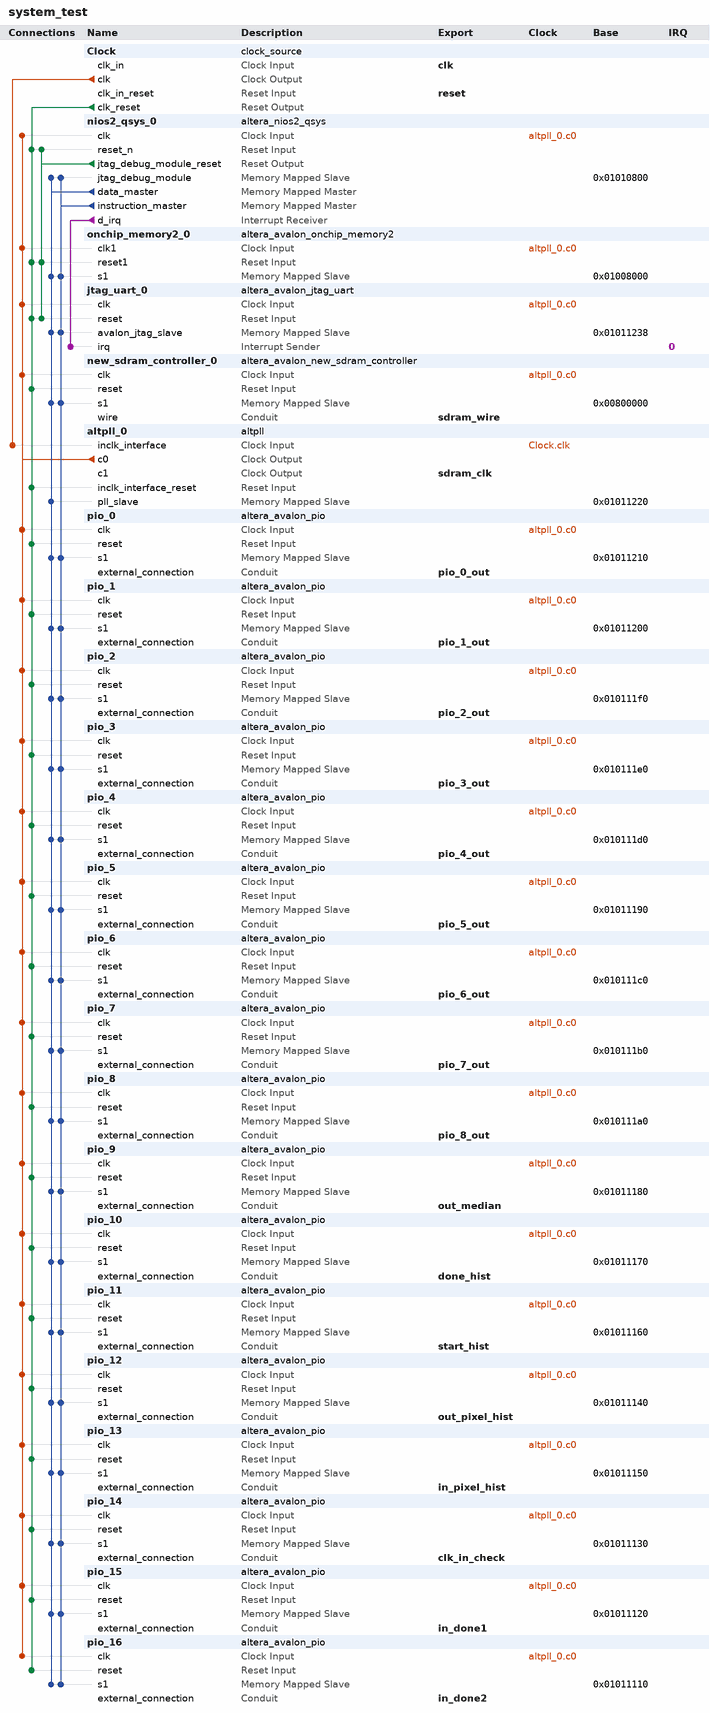
[diagram p0: system contents]
# Platform Designer (Qsys) system system_test, Cyclone II EP2C35F672C6
# Parameters at their usual value, and those the tool derives, are not listed.
package require -exact qsys 13.0.1.99.2
create_system system_test
set_project_property DEVICE_FAMILY {Cyclone II}
set_project_property DEVICE EP2C35F672C6

add_instance Clock clock_source 13.0
set_instance_parameter_value Clock clockFrequency 50000000

add_instance nios2_qsys_0 altera_nios2_qsys 13.0
set_instance_parameter_value nios2_qsys_0 resetSlave onchip_memory2_0.s1
set_instance_parameter_value nios2_qsys_0 mmu_TLBMissExcSlave None
set_instance_parameter_value nios2_qsys_0 exceptionSlave onchip_memory2_0.s1
set_instance_parameter_value nios2_qsys_0 breakSlave nios2_qsys_0.jtag_debug_module
set_instance_parameter_value nios2_qsys_0 impl Tiny
set_instance_parameter_value nios2_qsys_0 icache_size 4096

add_instance onchip_memory2_0 altera_avalon_onchip_memory2 13.0.1.99.2
set_instance_parameter_value onchip_memory2_0 dataWidth 32
set_instance_parameter_value onchip_memory2_0 dualPort false
set_instance_parameter_value onchip_memory2_0 initMemContent true
set_instance_parameter_value onchip_memory2_0 initializationFileName onchip_mem.hex
set_instance_parameter_value onchip_memory2_0 memorySize 32768

add_instance jtag_uart_0 altera_avalon_jtag_uart 13.0.1.99.2
set_instance_parameter_value jtag_uart_0 simInteractiveOptions NO_INTERACTIVE_WINDOWS

add_instance new_sdram_controller_0 altera_avalon_new_sdram_controller 13.0.1.99.2
set_instance_parameter_value new_sdram_controller_0 TAC 5.5
set_instance_parameter_value new_sdram_controller_0 TRCD 20.0
set_instance_parameter_value new_sdram_controller_0 TRP 20.0
set_instance_parameter_value new_sdram_controller_0 casLatency 3
set_instance_parameter_value new_sdram_controller_0 columnWidth 8
set_instance_parameter_value new_sdram_controller_0 dataWidth 16
set_instance_parameter_value new_sdram_controller_0 generateSimulationModel false
set_instance_parameter_value new_sdram_controller_0 model single_Micron_MT48LC4M32B2_7_chip
set_instance_parameter_value new_sdram_controller_0 numberOfBanks 4
set_instance_parameter_value new_sdram_controller_0 numberOfChipSelects 1
set_instance_parameter_value new_sdram_controller_0 powerUpDelay 100.0
set_instance_parameter_value new_sdram_controller_0 refreshPeriod 15.625
set_instance_parameter_value new_sdram_controller_0 rowWidth 12

add_instance altpll_0 altpll 13.0
set_instance_parameter_value altpll_0 INCLK0_INPUT_FREQUENCY 20000
set_instance_parameter_value altpll_0 GATE_LOCK_SIGNAL NO
set_instance_parameter_value altpll_0 VALID_LOCK_MULTIPLIER 1
set_instance_parameter_value altpll_0 INVALID_LOCK_MULTIPLIER 5
set_instance_parameter_value altpll_0 CLK0_MULTIPLY_BY 1
set_instance_parameter_value altpll_0 CLK1_MULTIPLY_BY 1
set_instance_parameter_value altpll_0 CLK0_DIVIDE_BY 1
set_instance_parameter_value altpll_0 CLK1_DIVIDE_BY 1
set_instance_parameter_value altpll_0 CLK1_PHASE_SHIFT -3000
set_instance_parameter_value altpll_0 CLK1_DUTY_CYCLE 50
set_instance_parameter_value altpll_0 PORT_clk1 PORT_USED
set_instance_parameter_value altpll_0 PORT_clk2 PORT_UNUSED
set_instance_parameter_value altpll_0 PORT_clk3 PORT_UNUSED
set_instance_parameter_value altpll_0 PORT_ARESET PORT_USED
set_instance_parameter_value altpll_0 PORT_LOCKED PORT_USED

add_instance pio_0 altera_avalon_pio 13.0.1.99.2
set_instance_parameter_value pio_0 direction Output
set_instance_parameter_value pio_0 width 8

add_instance pio_1 altera_avalon_pio 13.0.1.99.2
set_instance_parameter_value pio_1 direction Output
set_instance_parameter_value pio_1 width 8

add_instance pio_2 altera_avalon_pio 13.0.1.99.2
set_instance_parameter_value pio_2 direction Output
set_instance_parameter_value pio_2 width 8

add_instance pio_3 altera_avalon_pio 13.0.1.99.2
set_instance_parameter_value pio_3 direction Output
set_instance_parameter_value pio_3 width 8

add_instance pio_4 altera_avalon_pio 13.0.1.99.2
set_instance_parameter_value pio_4 direction Output
set_instance_parameter_value pio_4 width 8

add_instance pio_5 altera_avalon_pio 13.0.1.99.2
set_instance_parameter_value pio_5 direction Output
set_instance_parameter_value pio_5 width 8

add_instance pio_6 altera_avalon_pio 13.0.1.99.2
set_instance_parameter_value pio_6 direction Output
set_instance_parameter_value pio_6 width 8

add_instance pio_7 altera_avalon_pio 13.0.1.99.2
set_instance_parameter_value pio_7 direction Output
set_instance_parameter_value pio_7 width 8

add_instance pio_8 altera_avalon_pio 13.0.1.99.2
set_instance_parameter_value pio_8 direction Output
set_instance_parameter_value pio_8 width 8

add_instance pio_9 altera_avalon_pio 13.0.1.99.2
set_instance_parameter_value pio_9 direction Input
set_instance_parameter_value pio_9 width 8

add_instance pio_10 altera_avalon_pio 13.0.1.99.2
set_instance_parameter_value pio_10 direction Input
set_instance_parameter_value pio_10 width 1

add_instance pio_11 altera_avalon_pio 13.0.1.99.2
set_instance_parameter_value pio_11 direction Output
set_instance_parameter_value pio_11 width 1

add_instance pio_12 altera_avalon_pio 13.0.1.99.2
set_instance_parameter_value pio_12 direction Output
set_instance_parameter_value pio_12 width 8

add_instance pio_13 altera_avalon_pio 13.0.1.99.2
set_instance_parameter_value pio_13 direction Input
set_instance_parameter_value pio_13 width 8

add_instance pio_14 altera_avalon_pio 13.0.1.99.2
set_instance_parameter_value pio_14 direction Input
set_instance_parameter_value pio_14 width 1

add_instance pio_15 altera_avalon_pio 13.0.1.99.2
set_instance_parameter_value pio_15 direction Input
set_instance_parameter_value pio_15 width 1

add_instance pio_16 altera_avalon_pio 13.0.1.99.2
set_instance_parameter_value pio_16 direction Input
set_instance_parameter_value pio_16 width 1

# connections
add_connection altpll_0.c0 jtag_uart_0.clk clock
add_connection altpll_0.c0 new_sdram_controller_0.clk clock
add_connection altpll_0.c0 nios2_qsys_0.clk clock
add_connection altpll_0.c0 onchip_memory2_0.clk1 clock
add_connection altpll_0.c0 pio_0.clk clock
add_connection altpll_0.c0 pio_1.clk clock
add_connection altpll_0.c0 pio_2.clk clock
add_connection altpll_0.c0 pio_3.clk clock
add_connection altpll_0.c0 pio_4.clk clock
add_connection altpll_0.c0 pio_5.clk clock
add_connection altpll_0.c0 pio_6.clk clock
add_connection altpll_0.c0 pio_7.clk clock
add_connection altpll_0.c0 pio_8.clk clock
add_connection altpll_0.c0 pio_9.clk clock
add_connection altpll_0.c0 pio_10.clk clock
add_connection altpll_0.c0 pio_11.clk clock
add_connection altpll_0.c0 pio_12.clk clock
add_connection altpll_0.c0 pio_13.clk clock
add_connection altpll_0.c0 pio_14.clk clock
add_connection altpll_0.c0 pio_15.clk clock
add_connection altpll_0.c0 pio_16.clk clock
add_connection Clock.clk altpll_0.inclk_interface clock
add_connection Clock.clk_reset altpll_0.inclk_interface_reset reset
add_connection Clock.clk_reset jtag_uart_0.reset reset
add_connection Clock.clk_reset new_sdram_controller_0.reset reset
add_connection Clock.clk_reset nios2_qsys_0.reset_n reset
add_connection Clock.clk_reset onchip_memory2_0.reset1 reset
add_connection Clock.clk_reset pio_0.reset reset
add_connection Clock.clk_reset pio_1.reset reset
add_connection Clock.clk_reset pio_2.reset reset
add_connection Clock.clk_reset pio_3.reset reset
add_connection Clock.clk_reset pio_4.reset reset
add_connection Clock.clk_reset pio_5.reset reset
add_connection Clock.clk_reset pio_6.reset reset
add_connection Clock.clk_reset pio_7.reset reset
add_connection Clock.clk_reset pio_8.reset reset
add_connection Clock.clk_reset pio_9.reset reset
add_connection Clock.clk_reset pio_10.reset reset
add_connection Clock.clk_reset pio_11.reset reset
add_connection Clock.clk_reset pio_12.reset reset
add_connection Clock.clk_reset pio_13.reset reset
add_connection Clock.clk_reset pio_14.reset reset
add_connection Clock.clk_reset pio_15.reset reset
add_connection Clock.clk_reset pio_16.reset reset
add_connection nios2_qsys_0.jtag_debug_module_reset jtag_uart_0.reset reset
add_connection nios2_qsys_0.jtag_debug_module_reset nios2_qsys_0.reset_n reset
add_connection nios2_qsys_0.jtag_debug_module_reset onchip_memory2_0.reset1 reset
add_connection nios2_qsys_0.data_master altpll_0.pll_slave avalon
set_connection_parameter_value nios2_qsys_0.data_master/altpll_0.pll_slave baseAddress 0x01011220
add_connection nios2_qsys_0.data_master jtag_uart_0.avalon_jtag_slave avalon
set_connection_parameter_value nios2_qsys_0.data_master/jtag_uart_0.avalon_jtag_slave baseAddress 0x01011238
add_connection nios2_qsys_0.data_master new_sdram_controller_0.s1 avalon
set_connection_parameter_value nios2_qsys_0.data_master/new_sdram_controller_0.s1 baseAddress 0x00800000
add_connection nios2_qsys_0.data_master nios2_qsys_0.jtag_debug_module avalon
set_connection_parameter_value nios2_qsys_0.data_master/nios2_qsys_0.jtag_debug_module baseAddress 0x01010800
add_connection nios2_qsys_0.data_master onchip_memory2_0.s1 avalon
set_connection_parameter_value nios2_qsys_0.data_master/onchip_memory2_0.s1 baseAddress 0x01008000
add_connection nios2_qsys_0.data_master pio_0.s1 avalon
set_connection_parameter_value nios2_qsys_0.data_master/pio_0.s1 baseAddress 0x01011210
add_connection nios2_qsys_0.data_master pio_1.s1 avalon
set_connection_parameter_value nios2_qsys_0.data_master/pio_1.s1 baseAddress 0x01011200
add_connection nios2_qsys_0.data_master pio_2.s1 avalon
set_connection_parameter_value nios2_qsys_0.data_master/pio_2.s1 baseAddress 0x010111f0
add_connection nios2_qsys_0.data_master pio_3.s1 avalon
set_connection_parameter_value nios2_qsys_0.data_master/pio_3.s1 baseAddress 0x010111e0
add_connection nios2_qsys_0.data_master pio_4.s1 avalon
set_connection_parameter_value nios2_qsys_0.data_master/pio_4.s1 baseAddress 0x010111d0
add_connection nios2_qsys_0.data_master pio_5.s1 avalon
set_connection_parameter_value nios2_qsys_0.data_master/pio_5.s1 baseAddress 0x01011190
add_connection nios2_qsys_0.data_master pio_6.s1 avalon
set_connection_parameter_value nios2_qsys_0.data_master/pio_6.s1 baseAddress 0x010111c0
add_connection nios2_qsys_0.data_master pio_7.s1 avalon
set_connection_parameter_value nios2_qsys_0.data_master/pio_7.s1 baseAddress 0x010111b0
add_connection nios2_qsys_0.data_master pio_8.s1 avalon
set_connection_parameter_value nios2_qsys_0.data_master/pio_8.s1 baseAddress 0x010111a0
add_connection nios2_qsys_0.data_master pio_9.s1 avalon
set_connection_parameter_value nios2_qsys_0.data_master/pio_9.s1 baseAddress 0x01011180
add_connection nios2_qsys_0.data_master pio_10.s1 avalon
set_connection_parameter_value nios2_qsys_0.data_master/pio_10.s1 baseAddress 0x01011170
add_connection nios2_qsys_0.data_master pio_11.s1 avalon
set_connection_parameter_value nios2_qsys_0.data_master/pio_11.s1 baseAddress 0x01011160
add_connection nios2_qsys_0.data_master pio_12.s1 avalon
set_connection_parameter_value nios2_qsys_0.data_master/pio_12.s1 baseAddress 0x01011140
add_connection nios2_qsys_0.data_master pio_13.s1 avalon
set_connection_parameter_value nios2_qsys_0.data_master/pio_13.s1 baseAddress 0x01011150
add_connection nios2_qsys_0.data_master pio_14.s1 avalon
set_connection_parameter_value nios2_qsys_0.data_master/pio_14.s1 baseAddress 0x01011130
add_connection nios2_qsys_0.data_master pio_15.s1 avalon
set_connection_parameter_value nios2_qsys_0.data_master/pio_15.s1 baseAddress 0x01011120
add_connection nios2_qsys_0.data_master pio_16.s1 avalon
set_connection_parameter_value nios2_qsys_0.data_master/pio_16.s1 baseAddress 0x01011110
add_connection nios2_qsys_0.instruction_master jtag_uart_0.avalon_jtag_slave avalon
set_connection_parameter_value nios2_qsys_0.instruction_master/jtag_uart_0.avalon_jtag_slave baseAddress 0x01011238
add_connection nios2_qsys_0.instruction_master new_sdram_controller_0.s1 avalon
set_connection_parameter_value nios2_qsys_0.instruction_master/new_sdram_controller_0.s1 baseAddress 0x00800000
add_connection nios2_qsys_0.instruction_master nios2_qsys_0.jtag_debug_module avalon
set_connection_parameter_value nios2_qsys_0.instruction_master/nios2_qsys_0.jtag_debug_module baseAddress 0x01010800
add_connection nios2_qsys_0.instruction_master onchip_memory2_0.s1 avalon
set_connection_parameter_value nios2_qsys_0.instruction_master/onchip_memory2_0.s1 baseAddress 0x01008000
add_connection nios2_qsys_0.instruction_master pio_0.s1 avalon
set_connection_parameter_value nios2_qsys_0.instruction_master/pio_0.s1 baseAddress 0x01011210
add_connection nios2_qsys_0.instruction_master pio_1.s1 avalon
set_connection_parameter_value nios2_qsys_0.instruction_master/pio_1.s1 baseAddress 0x01011200
add_connection nios2_qsys_0.instruction_master pio_2.s1 avalon
set_connection_parameter_value nios2_qsys_0.instruction_master/pio_2.s1 baseAddress 0x010111f0
add_connection nios2_qsys_0.instruction_master pio_3.s1 avalon
set_connection_parameter_value nios2_qsys_0.instruction_master/pio_3.s1 baseAddress 0x010111e0
add_connection nios2_qsys_0.instruction_master pio_4.s1 avalon
set_connection_parameter_value nios2_qsys_0.instruction_master/pio_4.s1 baseAddress 0x010111d0
add_connection nios2_qsys_0.instruction_master pio_5.s1 avalon
set_connection_parameter_value nios2_qsys_0.instruction_master/pio_5.s1 baseAddress 0x01011190
add_connection nios2_qsys_0.instruction_master pio_6.s1 avalon
set_connection_parameter_value nios2_qsys_0.instruction_master/pio_6.s1 baseAddress 0x010111c0
add_connection nios2_qsys_0.instruction_master pio_7.s1 avalon
set_connection_parameter_value nios2_qsys_0.instruction_master/pio_7.s1 baseAddress 0x010111b0
add_connection nios2_qsys_0.instruction_master pio_8.s1 avalon
set_connection_parameter_value nios2_qsys_0.instruction_master/pio_8.s1 baseAddress 0x010111a0
add_connection nios2_qsys_0.instruction_master pio_9.s1 avalon
set_connection_parameter_value nios2_qsys_0.instruction_master/pio_9.s1 baseAddress 0x01011180
add_connection nios2_qsys_0.instruction_master pio_10.s1 avalon
set_connection_parameter_value nios2_qsys_0.instruction_master/pio_10.s1 baseAddress 0x01011170
add_connection nios2_qsys_0.instruction_master pio_11.s1 avalon
set_connection_parameter_value nios2_qsys_0.instruction_master/pio_11.s1 baseAddress 0x01011160
add_connection nios2_qsys_0.instruction_master pio_12.s1 avalon
set_connection_parameter_value nios2_qsys_0.instruction_master/pio_12.s1 baseAddress 0x01011140
add_connection nios2_qsys_0.instruction_master pio_13.s1 avalon
set_connection_parameter_value nios2_qsys_0.instruction_master/pio_13.s1 baseAddress 0x01011150
add_connection nios2_qsys_0.instruction_master pio_14.s1 avalon
set_connection_parameter_value nios2_qsys_0.instruction_master/pio_14.s1 baseAddress 0x01011130
add_connection nios2_qsys_0.instruction_master pio_15.s1 avalon
set_connection_parameter_value nios2_qsys_0.instruction_master/pio_15.s1 baseAddress 0x01011120
add_connection nios2_qsys_0.instruction_master pio_16.s1 avalon
set_connection_parameter_value nios2_qsys_0.instruction_master/pio_16.s1 baseAddress 0x01011110
add_connection nios2_qsys_0.d_irq jtag_uart_0.irq interrupt
set_connection_parameter_value nios2_qsys_0.d_irq/jtag_uart_0.irq irqNumber 0

# exported interfaces
add_interface clk clock sink
set_interface_property clk EXPORT_OF Clock.clk_in
add_interface reset reset sink
set_interface_property reset EXPORT_OF Clock.clk_in_reset
add_interface sdram_clk clock source
set_interface_property sdram_clk EXPORT_OF altpll_0.c1
add_interface sdram_wire conduit end
set_interface_property sdram_wire EXPORT_OF new_sdram_controller_0.wire
add_interface pio_0_out conduit end
set_interface_property pio_0_out EXPORT_OF pio_0.external_connection
add_interface pio_1_out conduit end
set_interface_property pio_1_out EXPORT_OF pio_1.external_connection
add_interface pio_2_out conduit end
set_interface_property pio_2_out EXPORT_OF pio_2.external_connection
add_interface pio_3_out conduit end
set_interface_property pio_3_out EXPORT_OF pio_3.external_connection
add_interface pio_4_out conduit end
set_interface_property pio_4_out EXPORT_OF pio_4.external_connection
add_interface pio_5_out conduit end
set_interface_property pio_5_out EXPORT_OF pio_5.external_connection
add_interface pio_6_out conduit end
set_interface_property pio_6_out EXPORT_OF pio_6.external_connection
add_interface pio_7_out conduit end
set_interface_property pio_7_out EXPORT_OF pio_7.external_connection
add_interface pio_8_out conduit end
set_interface_property pio_8_out EXPORT_OF pio_8.external_connection
add_interface out_median conduit end
set_interface_property out_median EXPORT_OF pio_9.external_connection
add_interface done_hist conduit end
set_interface_property done_hist EXPORT_OF pio_10.external_connection
add_interface start_hist conduit end
set_interface_property start_hist EXPORT_OF pio_11.external_connection
add_interface out_pixel_hist conduit end
set_interface_property out_pixel_hist EXPORT_OF pio_12.external_connection
add_interface in_pixel_hist conduit end
set_interface_property in_pixel_hist EXPORT_OF pio_13.external_connection
add_interface clk_in_check conduit end
set_interface_property clk_in_check EXPORT_OF pio_14.external_connection
add_interface in_done1 conduit end
set_interface_property in_done1 EXPORT_OF pio_15.external_connection
add_interface in_done2 conduit end
set_interface_property in_done2 EXPORT_OF pio_16.external_connection

set_interconnect_requirement {$system} qsys_mm.clockCrossingAdapter HANDSHAKE
set_interconnect_requirement {$system} qsys_mm.maxAdditionalLatency 1

save_system system_test.qsys
